# EAGLE design teensy_amp_R3b (EAGLE 9.6.2)
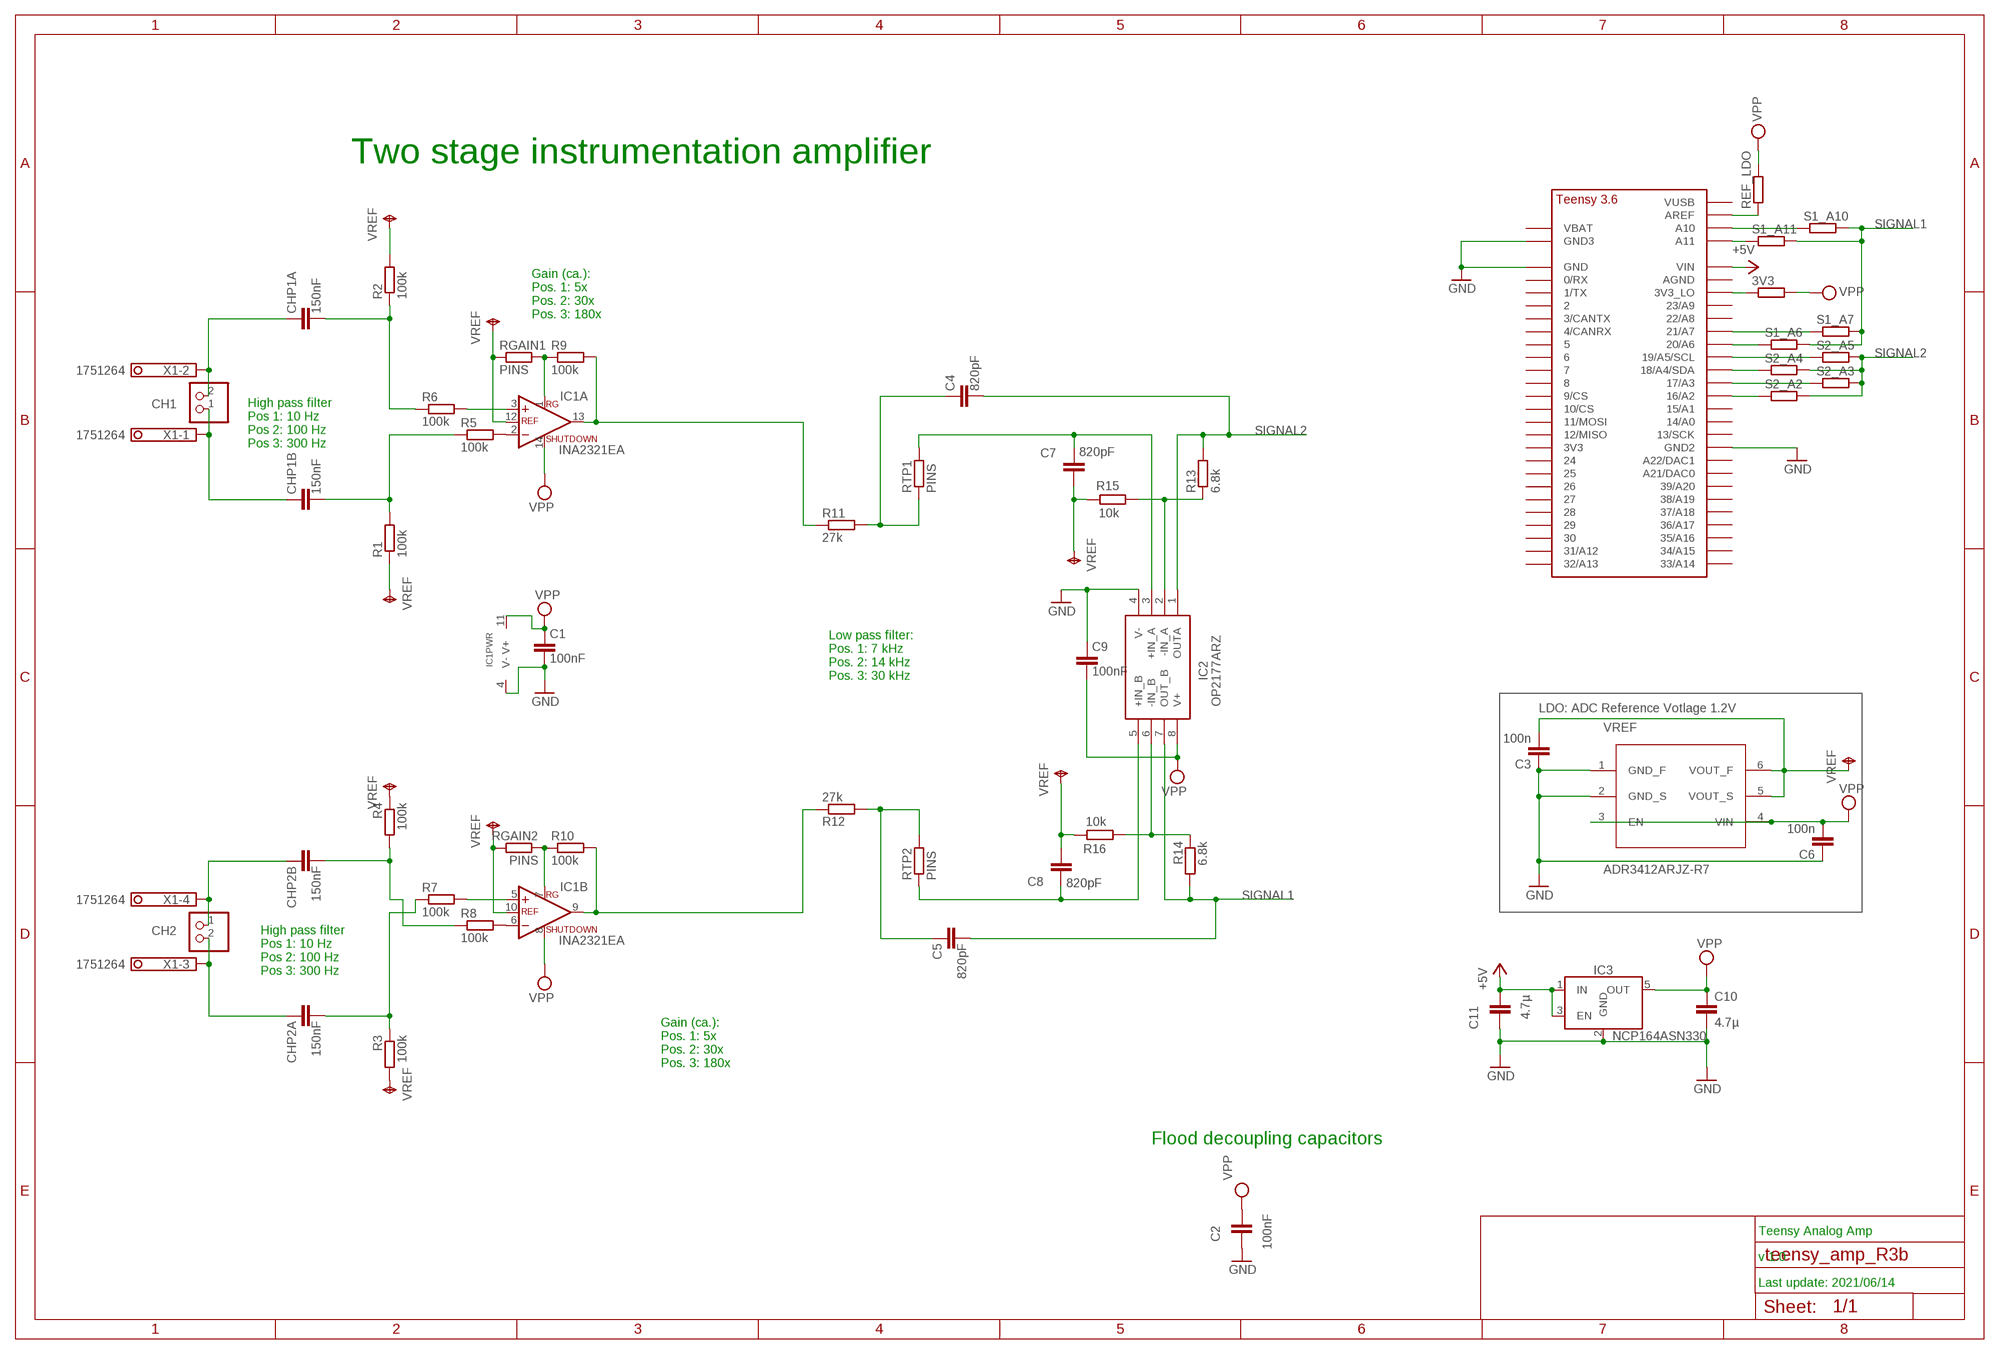
[diagram p0: schematic, sheet 1]

## Parts
3V3  R_JLM0402-NARROW  [0402-N]
C1  100nF  C-EUC0603  [C0603]
C2  100nF  C-EUC0603  [C0603]
C3  100n  C-EUC0603  [C0603]
C4  820pF  C-EUC0603  [C0603]
C5  820pF  C-EUC0603  [C0603]
C6  100n  C-EUC0603  [C0603]
C7  820pF  C-EUC0603  [C0603]
C8  820pF  C-EUC0603  [C0603]
C9  100nF  C-EUC0603  [C0603]
C10  4.7µ  C-EUC0603  [C0603]
C11  4.7µ  C-EUC0603  [C0603]
CH1  PINHD-1X2  [1X02]
CH2  PINHD-1X2  [1X02]
CHP1A  150nF  C-EUC_PINS  [C_PINS]
CHP1B  150nF  C-EUC_PINS  [C_PINS]
CHP2A  150nF  C-EUC_PINS  [C_PINS]
CHP2B  150nF  C-EUC_PINS  [C_PINS]
IC1  INA2321EA  [TSSOP14]
IC2  OP2177ARZ  [SOIC127P600X175-8N]
IC3  NCP164ASN330  LDO_ENSOT23-5  [SOT23-5]
R1  100k  R_JLMR0603  [R0603]
R2  100k  R_JLMR0603  [R0603]
R3  100k  R_JLMR0603  [R0603]
R4  100k  R_JLMR0603  [R0603]
R5  100k  R_JLMR0603  [R0603]
R6  100k  R_JLMR0603  [R0603]
R7  100k  R_JLMR0603  [R0603]
R8  100k  R_JLMR0603  [R0603]
R9  100k  R_JLMR0603  [R0603]
R10  100k  R_JLMR0603  [R0603]
R11  27k  R_JLMR0603  [R0603]
R12  27k  R_JLMR0603  [R0603]
R13  6.8k  R_JLMR0603  [R0603]
R14  6.8k  R_JLMR0603  [R0603]
R15  10k  R_JLMR0603  [R0603]
R16  10k  R_JLMR0603  [R0603]
REF_LDO  R_JLM0402-NARROW  [0402-N]
RGAIN1  PINS  R_JLMPINS  [R_PINS]
RGAIN2  PINS  R_JLMPINS  [R_PINS]
RTP1  PINS  R_JLMPINS  [R_PINS]
RTP2  PINS  R_JLMPINS  [R_PINS]
S1_A6  R_JLM0402-NARROW  [0402-N]
S1_A7  R_JLM0402-NARROW  [0402-N]
S1_A10  R_JLM0402-NARROW  [0402-N]
S1_A11  R_JLM0402-NARROW  [0402-N]
S2_A2  R_JLM0402-NARROW  [0402-N]
S2_A3  R_JLM0402-NARROW  [0402-N]
S2_A4  R_JLM0402-NARROW  [0402-N]
S2_A5  R_JLM0402-NARROW  [0402-N]
U$1  TEENSY_3.5/3.6_SOCKET_VBAT  [TEENY_3.5/3.6_SOCKET_VBAT]
VREF  ADR3412ARJZ-R7  [SOT23-6]
X1  1751264  [1751264]

## Nets
+5V: C11.2 IC3.1(IN) IC3.3(EN) U$1.VIN
GND: C1.2 C2.1 C3.1 C6.1 C9.1 C10.2 C11.1 IC1.4(PWR:V-) IC2.4(V-) IC3.2(GND) U$1.GND U$1.GND2 U$1.GND3 VREF.1(GND_F) VREF.2(GND_S)
N$1: CH1.2 CHP1A.1 X1.2
N$2: CH1.1 CHP1B.1 X1.1
N$3: C4.1 R11.2 RTP1.1
N$4: IC1.2(A:-IN) R5.2
N$5: IC1.1(A:RG) R9.1 RGAIN1.2
N$6: IC1.3(A:+IN) R6.2
N$7: S1_A10.1 U$1.A10
N$8: IC1.7(B:RG) R10.1 RGAIN2.1
N$9: IC1.6(B:-IN) R8.2
N$10: IC1.5(B:+IN) R7.2
N$11: REF_LDO.1 U$1.AREF
N$12: CH2.1 CHP2B.1 X1.4
N$13: CH2.2 CHP2A.1 X1.3
N$14: S1_A11.1 U$1.A11
N$15: CHP1B.2 R1.2 R5.1
N$16: CHP1A.2 R2.1 R6.1
N$17: S1_A6.1 U$1.20/A6
N$18: S1_A7.1 U$1.21/A7
N$19: IC1.13(A:OUT) R9.2 R11.1
N$20: IC2.2(-IN_A) R13.1 R15.1
N$21: S2_A5.1 U$1.19/A5/SCL
N$22: C7.1 IC2.3(+IN_A) RTP1.2
N$23: S2_A4.1 U$1.18/A4/SDA
N$24: S2_A3.1 U$1.17/A3
N$25: S2_A2.1 U$1.16/A2
N$26: 3V3.1 U$1.3V3_LO
N$38: CHP2B.2 R4.2 R8.1
N$39: CHP2A.2 R3.1 R7.1
N$42: C5.1 R12.2 RTP2.2
N$49: IC1.9(B:OUT) R10.2 R12.1
N$50: C8.1 IC2.5(+IN_B) RTP2.1
N$51: IC2.6(-IN_B) R14.1 R16.1
SIGNAL1: C5.2 IC2.7(OUT_B) R14.2 S1_A6.2 S1_A7.2 S1_A10.2 S1_A11.2
SIGNAL2: C4.2 IC2.1(OUTA) R13.2 S2_A2.2 S2_A3.2 S2_A4.2 S2_A5.2
VDD: 3V3.2 C1.1 C2.2 C6.2 C9.2 C10.1 IC1.8(B:SHUTDOWN) IC1.11(PWR:V+) IC1.14(A:SHUTDOWN) IC2.8(V+) IC3.5(OUT) REF_LDO.2 VREF.3(EN) VREF.4(VIN) ; supply symbol labelled VPP
VREF: C3.2 C7.2 C8.2 IC1.10(B:REF) IC1.12(A:REF) R1.1 R2.2 R3.2 R4.1 R15.2 R16.2 RGAIN1.1 RGAIN2.2 VREF.5(VOUT_S) VREF.6(VOUT_F)
Unconnected: U$1.0/RX U$1.1/TX U$1.2 U$1.3/CANTX U$1.3V3 U$1.4/CANRX U$1.5 U$1.6 U$1.7 U$1.8 U$1.9/CS U$1.10/CS U$1.11/MOSI U$1.12/MISO U$1.13/SCK U$1.14/A0 U$1.15/A1 U$1.21/DAC0(A21/DAC0) U$1.22/A8 U$1.23/A9 U$1.24 U$1.25 U$1.26 U$1.27 U$1.28 U$1.29 U$1.30 U$1.31/A12 U$1.32/A13 U$1.33/A14 U$1.34/A15 U$1.35/A16 U$1.36/A17 U$1.37/A18 U$1.38/A19 U$1.39/A20 U$1.A22/DAC1 U$1.AGND U$1.VBAT U$1.VUSB

## Notes on the sheet
- Two stage instrumentation amplifier
- Gain (ca.):
  Pos. 1: 5x
  Pos. 2: 30x
  Pos. 3: 180x
- High pass filter
  Pos 1: 10 Hz
  Pos 2: 100 Hz
  Pos 3: 300 Hz
- Low pass filter:
  Pos. 1: 7 kHz
  Pos. 2: 14 kHz
  Pos. 3: 30 kHz
- LDO: ADC Reference Votlage 1.2V
- High pass filter
  Pos 1: 10 Hz
  Pos 2: 100 Hz
  Pos 3: 300 Hz
- Gain (ca.):
  Pos. 1: 5x
  Pos. 2: 30x
  Pos. 3: 180x
- Flood decoupling capacitors
- Teensy Analog Amp
- v 1.0
- Last update: 2021/06/14

## Library data of the parts
3V3 R1-R16 REF_LDO RGAIN1 RGAIN2 RTP1 RTP2 S1_A6 S1_A7 S1_A10 S1_A11 S2_A2-S2_A5 = jlm_resistors:R_JLM: RESISTOR, European symbol
C1-C11 CHP1A CHP1B CHP2A CHP2B = jlm_cap:C-EU: CAPACITOR, European symbol
CH1 CH2 = pinhead:PINHD-1X2: PIN HEADER
IC1 = jlm_linear:INA2321: INA 2321 dual instrument amplifier Dual instrument amplifier with RG, Ref and Shutdown
IC2 = SamacSys_Parts:OP2177ARZ: OP2177ARZ, Dual Operational Amplifier 1.3MHz, 8-Pin SOIC Source: Datasheet; DESCRIPTION: OP2177ARZ, Dual Operational Amplifier 1.3MHz, 8-Pin SOIC; HEIGHT: 1.75mm; MANUFACTURER_NAME: Analog Devices; MANUFACTURER_PART_NUMBER: OP2177ARZ; MOUSER_PART_NUMBER: 584-OP2177ARZ; MOUSER_PRICE-STOCK: https://www.mouser.co.uk/ProductDetail/Analog-Devices/OP2177ARZ?qs=WIvQP4zGaniPKKe90KoQ%252BA%3D%3D
IC3 = jlm_power:LDO_EN
U$1 = jlm_micro:TEENSY_3.5/3.6_SOCKET_VBAT
VREF = jlm_power:ADR3412ARJZ-R7: 1.2 V Voltage reference with enable pin; OC_FARNELL: 2377030; OC_MOUSER: 584-ADR3412ARJZ-R7
X1 = jlm_con:1751264: MKDS 1/ 4-3,5 Printklemme Nennstrom: 10 A Bemessungsspannung: 160 V Raster: 3,5 mm Polzahl: 4 Montageart: Löten Anschlussart: Schraubanschluss Anschlussrichtung vom Leiter zur Platine: 0° Source: http://eshop.phoenixcontact.com .. 1751264.pdf; MPN: 1751264; OC_FARNELL: unknown; OC_NEWARK: 10R0934

## Net classes
0 default: width 0.203 mm, clearance 0.205 mm

## Board
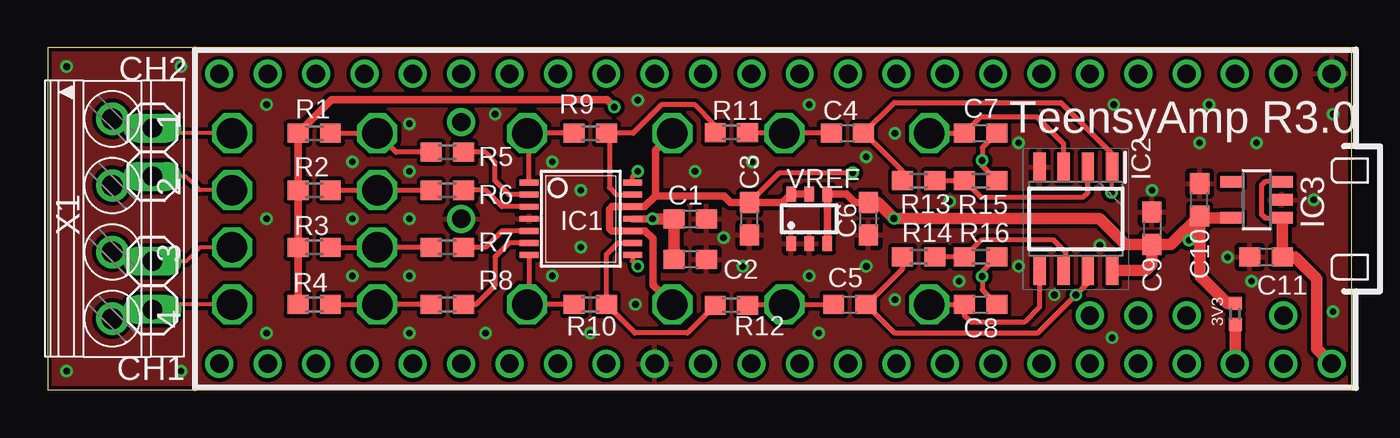
[diagram p1: board, top side]
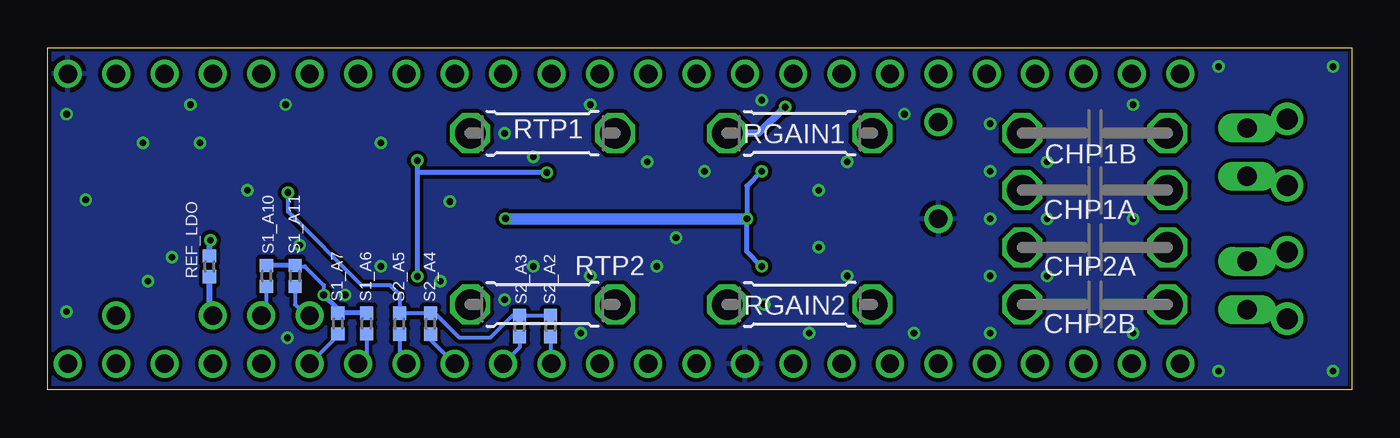
[diagram p2: board, bottom side, seen from below]

Size 68.5 x 18 mm. Coordinates in mm from the lower left corner, seen from the top.
Outline: 0,0 68.5,0 68.5,18 0,18 0,0
Copper layers (1*16): Top 0.035mm / dielectric 1.5mm / Bottom 0.035mm
Design rules "aisler_2_layer *": minimum track width 0.1mm, minimum drill 0.2mm, track to track 0.15mm, track to pad 0.15mm, pad to pad 0.1mm, via to via 0.1mm, smd to smd 0.1mm, copper to edge 0.2mm, drill to drill 0.21mm, minimum pad ring 0.25mm, minimum via ring 0.15mm, stop-mask expansion 0mil, vias tented up to drill 0.36mm, thermal gap 10mil

### Footprints (pad centres in the part's own frame; a part is rotated, then mirrored left to right if it is on the bottom)
0402-N = smd 0.7 x 0.7: 1 -0.55,0; 2 0.55,0
C0603 = smd 1.1 x 1: 1 -0.85,0; 2 0.85,0
1X02 = drill 1.016 long: 1 -1.27,0; 2 1.27,0
C_PINS = drill 1.6 octagon: 1 -3.81,0; 2 3.81,0
TSSOP14 = smd 0.305 x 0.991: 1 -1.905,-2.718; 2 -1.27,-2.718; 3 -0.635,-2.718; 4 0,-2.718; 5 0.635,-2.718; 6 1.27,-2.718; 7 1.905,-2.718; 8 1.905,2.718; 9 1.27,2.718; 10 0.635,2.718; 11 0,2.718; 12 -0.635,2.718; 13 -1.27,2.718; 14 -1.905,2.718
SOIC127P600X175-8N = smd 1.525 x 0.65: 1 -2.712,1.905; 2 -2.712,0.635; 3 -2.712,-0.635; 4 -2.712,-1.905; 5 2.712,-1.905; 6 2.712,-0.635; 7 2.712,0.635; 8 2.712,1.905
SOT23-5 = smd 0.6 x 1.2: 1 -0.95,-1.306; 2 0,-1.306; 3 0.95,-1.306; 4 0.95,1.306; 5 -0.95,1.306
R0603 = smd 1.1 x 1: 1 -0.85,0; 2 0.85,0
R_PINS = drill 1.6 octagon: 1 -3.81,0; 2 3.81,0
TEENY_3.5/3.6_SOCKET_VBAT = drill 0.965: 0/RX -25.4,-7.62; 1/TX -22.86,-7.62; 2 -20.32,-7.62; 3/CANTX -17.78,-7.62; 3V3 7.62,-7.62; 3V3_LO -22.86,7.62; 4/CANRX -15.24,-7.62; 5 -12.7,-7.62; 6 -10.16,-7.62; 7 -7.62,-7.62; 8 -5.08,-7.62; 9/CS -2.54,-7.62; 10/CS 0,-7.62; 11/MOSI 2.54,-7.62; 12/MISO 5.08,-7.62; 13/SCK 5.08,7.62; 14/A0 2.54,7.62; 15/A1 0,7.62; 16/A2 -2.54,7.62; 17/A3 -5.08,7.62; 18/A4/SDA -7.62,7.62; 19/A5/SCL -10.16,7.62; 20/A6 -12.7,7.62; 21/A7 -15.24,7.62; 21/DAC0 12.7,7.62; 22/A8 -17.78,7.62; 23/A9 -20.32,7.62; 24 10.16,-7.62; 25 12.7,-7.62; 26 15.24,-7.62; 27 17.78,-7.62; 28 20.32,-7.62; 29 22.86,-7.62; 30 25.4,-7.62; 31/A12 27.94,-7.62; 32/A13 30.48,-7.62; 33/A14 30.48,7.62; 34/A15 27.94,7.62; 35/A16 25.4,7.62; 36/A17 22.86,7.62; 37/A18 20.32,7.62; 38/A19 17.78,7.62; 39/A20 15.24,7.62; A10 -17.78,5.08; A11 -15.24,5.08; A22/DAC1 10.16,7.62; AGND -25.4,7.62; AREF -20.32,5.08; GND -27.94,-7.62; GND2 7.62,7.62; GND3 17.78,0; VBAT 17.78,-5.08; VIN -27.94,7.62; VUSB -25.4,5.08
SOT23-6 = smd 0.5 x 0.8: 1 -0.95,-1.3; 2 0,-1.3; 3 0.95,-1.3; 4 0.95,1.3; 5 0,1.3; 6 -0.95,1.3
1751264 = drill 1.1 pad 1.7: 1 -5.25,-0.1; 2 -1.75,-0.1; 3 1.75,-0.1; 4 5.25,-0.1

### Placement (x,y rotation side)
3V3  62.37,4 90 top
C1  33.75,9 0 top
C2  33.75,6.87 180 top
C3  36.87,9 90 top
C4  42.01,13.5 0 top
C5  42.13,4.5 0 top
C6  43.12,9 90 top
C7  49,13.5 0 top
C8  49,4.5 0 top
C9  58,8.5 270 top
C10  60.5,10 90 top
C11  64,7 0 top
CH1  5.5,12.5 270 top
CH2  5.5,5.5 90 top
CHP1A  13.5,10.5 180 bottom
CHP1B  13.5,13.5 180 bottom
CHP2A  13.5,7.5 180 bottom
CHP2B  13.5,4.5 180 bottom
IC1  28,9 270 top
IC2  54,9 270 top
IC3  63.5,10 90 top
R1  14,13.5 0 top
R2  14,10.5 180 top
R3  14,7.5 180 top
R4  14,4.5 0 top
R5  21,12.5 0 top
R6  21,10.5 0 top
R7  21,7.5 0 top
R8  21,4.5 0 top
R9  28.5,13.5 0 top
R10  28.5,4.5 0 top
R11  35.91,13.54 0 top
R12  35.91,4.46 0 top
R13  45.75,11 180 top
R14  45.75,7 180 top
R15  49,11 0 top
R16  49,7 0 top
REF_LDO  60,6.5 90 bottom
RGAIN1  29,13.5 0 bottom
RGAIN2  29,4.5 180 bottom
RTP1  42.5,13.5 180 bottom
RTP2  42.5,4.5 0 bottom
S1_A6  51.75,3.5 90 bottom
S1_A7  53.25,3.5 90 bottom
S1_A10  57,6 90 bottom
S1_A11  55.5,6 90 bottom
S2_A2  42.09,3.36 90 bottom
S2_A3  43.71,3.36 90 bottom
S2_A4  48.39,3.48 90 bottom
S2_A5  50.02,3.48 90 bottom
U$1  39.5,9 180 top
VREF  40,9 0 top
X1  3.5,9 270 top

### Tracks (layer width: path | path; a pad name or v marks a point on that pad's centre or on a via)
+5V
  Top 0.254: IC3.3 63.95,10.95 63.75,10.75 63.75,9.25 63.95,9.05 IC3.1
  Top 0.61: IC3.1 64.85,9.01 C11.2 65.5,7 66.65,5.85 66.65,2.17 U$1.VIN
GND  (via drill 0.35)
  other vias: 51,13 44.5,13.5 26.5,6 36.5,6.5 43,6.5 40.5,3 55.91,2.75 67.51,4.13 40,15 1,17 1,1 7,1 7,17 11.5,15 11.5,3 11.5,9 16,9 16,12 16,6 28,10.5 28,7.5 28.5,3 23,3 23.5,14.5 19,11.5 19,9 19,6 19,3 19,14 34,11.5 40,6 35.5,8 30.99,15.24 30.87,4.5 44.5,4.75 55.26,7.62 42.99,12.26 58,10.5 60.5,13 63.5,13 56,15 61,15 37,12 47.37,9.91 26.5,12 67.5,14.5 51,6.5 52.87,5 47.88,5.72 66.5,10 63.24,5.71 61.97,6.99
  pour Bottom: 0,18 68.5,18 68.5,0 0,0
  pour Top: 0,18 68.5,18 68.5,0 0,0
N$1
  Top 0.203: CHP1A.1 8,10.5 7.27,11.23 CH1.2 3.88,11.23 X1.2
N$2
  Top 0.203: CHP1B.1 5.77,13.5 CH1.1 3.88,13.77 X1.1
N$3
  Top 0.254: R11.2 38.65,13.54 RTP1.1 C4.1
N$4
  Top 0.254: IC1.2 24.23,10.27 23.5,11 23.5,11.99 22.99,12.5 R5.2
N$5
  Top 0.254: R9.1 RGAIN1.2 25.28,13.41 IC1.1
N$6
  Top 0.254: IC1.3 23.86,9.63 23,10.5 R6.2
N$7
  Bottom 0.203: U$1.A10 57.28,4.22 57,4.5 S1_A10.1
N$8
  Top 0.254: IC1.7 25.28,4.59 | 25.28,4.59 RGAIN2.1 | R10.1 25.37,4.5 25.28,4.59
N$9
  Top 0.254: IC1.6 24.23,7.73 23.5,7 23.5,5.5 22.5,4.5 R8.2
N$10
  Top 0.254: IC1.5 23.86,8.37 23,7.5 R7.2
N$11
  Bottom 0.305: U$1.AREF 59.82,4.27 60,4.45 REF_LDO.1
N$12
  Top 0.203: CHP2B.1 5.77,4.5 CH2.1 3.88,4.23 X1.4
N$13
  Top 0.203: CHP2A.1 8,7.5 7.27,6.77 CH2.2 3.88,6.77 X1.3
N$14
  Bottom 0.203: S1_A11.1 55.5,4.5 54.92,3.92 U$1.A11
N$15
  Top 0.254: R1.2 CHP1B.2 18.31,12.5 R5.1
N$16
  Top 0.254: R2.1 CHP1A.2 R6.1
N$17
  Bottom 0.203: S1_A6.1 51.75,1.83 U$1.20/A6
N$18
  Bottom 0.203: S1_A7.1 53.34,2.95 53.34,2.78 U$1.21/A7
N$19
  Top 0.254: IC1.13 29.86,10.27 29.5,10.63 29.5,13.35 R9.2 30.75,13.5 32.25,15 34,15 35.06,13.94 R11.1
N$20
  Top 0.254: R13.1 R15.1 49.02,10.13 54.38,10.13 54.63,10.39 IC2.2
N$21
  Bottom 0.203: S2_A5.1 50.02,1.74 U$1.19/A5/SCL
N$22
  Top 0.254: RTP1.2 C7.1 49,14.35 51.94,14.35 53.37,12.93 IC2.3
N$23
  Bottom 0.203: S2_A4.1 48.39,2.65 U$1.18/A4/SDA
N$24
  Bottom 0.203: S2_A3.1 43.71,2.25 U$1.17/A3
N$25
  Bottom 0.203: S2_A2.1 42.09,1.43 U$1.16/A2
N$26
  Top 0.61: 3V3.1 62.37,1.39 U$1.3V3_LO
N$38
  Top 0.254: R4.2 CHP2B.2 R8.1
N$39
  Top 0.254: R3.1 CHP2A.2 R7.1
N$42
  Top 0.254: R12.2 36.8,4.5 RTP2.2 C5.1
N$49
  Top 0.254: IC1.9 29.95,7.73 29.35,7.12 R10.2 30.85,3 33.6,3 R12.1
N$50
  Top 0.254: RTP2.1 C8.1 48.15,3.92 48.51,3.56 51.29,3.56 52.09,4.36 IC2.5
N$51
  Top 0.254: R14.1 R16.1 49.02,7.87 52.83,7.87 53.47,7.24 53.47,6.99 53.37,6.88 IC2.6
SIGNAL1  (via drill 0.35)
  Top 0.254: R14.2 44.9,6.37 43.04,4.5 C5.2 44.48,3 52,3 v54,5 54.63,5.63 IC2.7
  Bottom 0.203: S1_A11.2 55.45,6.5 55,6.5 54,5.5 v54,5
  Bottom 0.254: S1_A6.2 S1_A7.2 53.25,4.25 v54,5 | S1_A11.2 S1_A10.2
SIGNAL2  (via drill 0.35)
  Top 0.203: v55.87,10.38 55.91,10.41 55.91,12
  Top 0.254: R13.2 44.9,11.51 42.91,13.5 C4.2 44.47,15.11 53.21,15.11 55.91,12.42 55.91,12 IC2.1
  Bottom 0.203: S2_A2.2 S2_A3.2 44.09,3.91 45.25,2.75 46.87,2.75 48.16,4.03 S2_A4.2 S2_A5.2 50,4.05 50,5 50.5,5.5 52,5.5 55.87,9.37 v55.87,10.38
VDD  (via drill 0.35)
  Top 0.254: IC1.14 30.72,11.22 v31,11.5 | IC1.8 30.72,6.78 v31,6.5
  Top 0.406: VREF.3 VREF.4 41.95,10.3 42.4,9.85 C6.2 | IC1.11 v31.77,9 | v59.94,7.87 59.94,7.94 60.5,8.5
  Top 0.61: IC2.8 57.68,6.29 58,6.61 C9.2 | C6.2 43.62,9.85 v44.45,9.02 55.24,9.02 56.61,7.65 C9.2 | v31.77,9 C1.1 C2.2 | 3V3.2 61.95,4.55 60.5,6 60.5,8.5 C10.1 | IC3.5 60.6,9.05 C10.1 | C10.1 59,7.65 C9.2
  Bottom 0.254: v31,11.5 31.77,10.73 v31.77,9 31.77,7.27 v31,6.5
  Bottom 0.305: REF_LDO.2 60,7.82 v59.94,7.87
  Bottom 0.61: v31.77,9 44.43,9 v44.45,9.02
VREF  (via drill 0.35)
  Top 0.254: C7.2 49.09,12.74 v49.09,12.06 49.09,11.76 R15.2 | R16.2 49.09,6.24 v49.09,5.97 49.09,5.26 C8.2 | C3.2 38.45,11.43 v42.29,11.43
  Top 0.406: VREF.5 VREF.6 38.6,9.85 C3.2 35.87,9.85 35.52,10.2 31.92,10.2 | RGAIN1.1 31.92,12.61 31.92,10.2 | 31.92,10.2 31.35,9.63 IC1.12 29.64,9.63 29.5,9.5 29.5,8.5 29.64,8.37 IC1.10 31.39,8.37 31.79,7.96 31.79,5.52 RGAIN2.2 | R4.1 R3.2 R2.2 R1.1 14.9,15.25 29.38,15.25 v29.76,14.87
  Bottom 0.254: v49.09,12.06 49.09,11.43 | 49.09,11.43 v49.09,5.97 | v42.29,11.43 49.09,11.43
  Bottom 0.406: v29.76,14.87 29.79,14.87 31.16,13.5 RGAIN1.1

### Text on the board
tNames: TeensyAmp R3.0